# EAGLE design 1_ATMEGA_328P_AU (EAGLE 9.4.2)
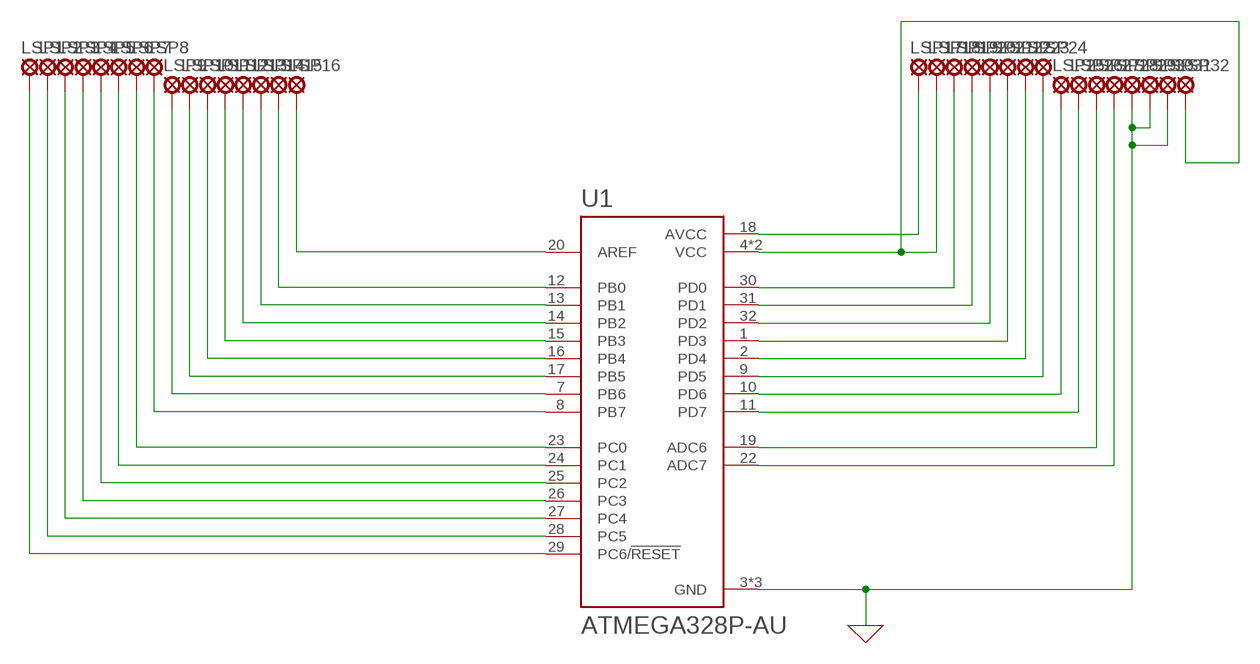
[diagram p0: schematic, sheet 1]

## Parts
LSP1  LSP10_CLSP10_C  [LSP10_C]
LSP2  LSP10_CLSP10_C  [LSP10_C]
LSP3  LSP10_CLSP10_C  [LSP10_C]
LSP4  LSP10_CLSP10_C  [LSP10_C]
LSP5  LSP10_CLSP10_C  [LSP10_C]
LSP6  LSP10_CLSP10_C  [LSP10_C]
LSP7  LSP10_CLSP10_C  [LSP10_C]
LSP8  LSP10_CLSP10_C  [LSP10_C]
LSP9  LSP10_CLSP10_C  [LSP10_C]
LSP10  LSP10_CLSP10_C  [LSP10_C]
LSP11  LSP10_CLSP10_C  [LSP10_C]
LSP12  LSP10_CLSP10_C  [LSP10_C]
LSP13  LSP10_CLSP10_C  [LSP10_C]
LSP14  LSP10_CLSP10_C  [LSP10_C]
LSP15  LSP10_CLSP10_C  [LSP10_C]
LSP16  LSP10_CLSP10_C  [LSP10_C]
LSP17  LSP10_CLSP10_C  [LSP10_C]
LSP18  LSP10_CLSP10_C  [LSP10_C]
LSP19  LSP10_CLSP10_C  [LSP10_C]
LSP20  LSP10_CLSP10_C  [LSP10_C]
LSP21  LSP10_CLSP10_C  [LSP10_C]
LSP22  LSP10_CLSP10_C  [LSP10_C]
LSP23  LSP10_CLSP10_C  [LSP10_C]
LSP24  LSP10_CLSP10_C  [LSP10_C]
LSP25  LSP10_CLSP10_C  [LSP10_C]
LSP26  LSP10_CLSP10_C  [LSP10_C]
LSP27  LSP10_CLSP10_C  [LSP10_C]
LSP28  LSP10_CLSP10_C  [LSP10_C]
LSP29  LSP10_CLSP10_C  [LSP10_C]
LSP30  LSP10_CLSP10_C  [LSP10_C]
LSP31  LSP10_CLSP10_C  [LSP10_C]
LSP32  LSP10_CLSP10_C  [LSP10_C]
U1  ATMEGA328P-AU  [QFP80P900X900X120-32N]

## Nets
0: LSP29.P$1(MP) LSP30.P$1(MP) LSP31.P$1(MP) U1.3(GND) U1.5(GND) U1.21(GND) ; supply symbol labelled GND
N$1: LSP1.P$1(MP) U1.29(PC6/!RESET)
N$2: LSP2.P$1(MP) U1.28(PC5)
N$3: LSP3.P$1(MP) U1.27(PC4)
N$4: LSP4.P$1(MP) U1.26(PC3)
N$5: LSP5.P$1(MP) U1.25(PC2)
N$6: LSP6.P$1(MP) U1.24(PC1)
N$7: LSP7.P$1(MP) U1.23(PC0)
N$8: LSP8.P$1(MP) U1.8(PB7)
N$9: LSP9.P$1(MP) U1.7(PB6)
N$10: LSP10.P$1(MP) U1.17(PB5)
N$11: LSP11.P$1(MP) U1.16(PB4)
N$12: LSP12.P$1(MP) U1.15(PB3)
N$13: LSP13.P$1(MP) U1.14(PB2)
N$14: LSP14.P$1(MP) U1.13(PB1)
N$15: LSP15.P$1(MP) U1.12(PB0)
N$16: LSP16.P$1(MP) U1.20(AREF)
N$17: LSP17.P$1(MP) U1.18(AVCC)
N$18: LSP18.P$1(MP) LSP32.P$1(MP) U1.4(VCC) U1.6(VCC)
N$19: LSP19.P$1(MP) U1.30(PD0)
N$20: LSP20.P$1(MP) U1.31(PD1)
N$21: LSP21.P$1(MP) U1.32(PD2)
N$22: LSP22.P$1(MP) U1.1(PD3)
N$23: LSP23.P$1(MP) U1.2(PD4)
N$24: LSP24.P$1(MP) U1.9(PD5)
N$25: LSP25.P$1(MP) U1.10(PD6)
N$26: LSP26.P$1(MP) U1.11(PD7)
N$27: LSP27.P$1(MP) U1.19(ADC6)
N$28: LSP28.P$1(MP) U1.22(ADC7)

## Library data of the parts
LSP1-LSP32 = tbtaco-solpad:LSP10_C: SOLDER PAD drill 1.0 mm, distributor Buerklin, 12H555
U1 = ATMEGA328P-AU:ATMEGA328P-AU: ATmega Series 20 MHz 32 KB Flash 2 KB SRAM 8-Bit Microcontroller - TQFP-32; AVAILABILITY: Unavailable; DESCRIPTION: Microcontroller Mcu, 8 Bit, Atmega, 20mhz, Tqfp-32; MF: Microchip; MP: ATMEGA328P-AU; PACKAGE: TQFP-32 Microchip; PRICE: None

## Board
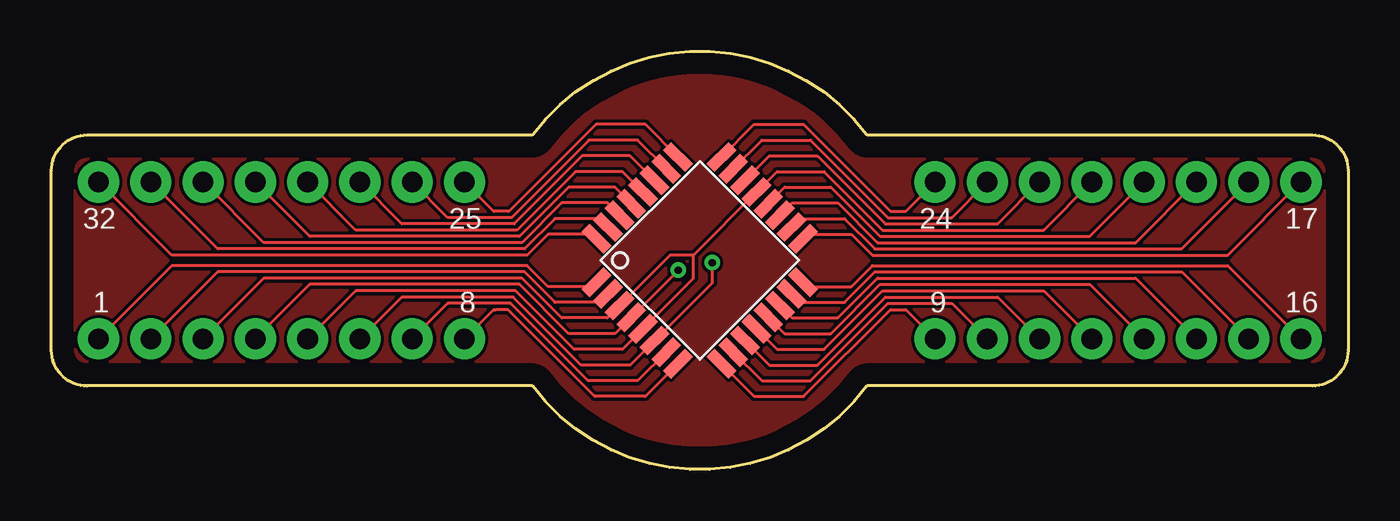
[diagram p1: board, top side]
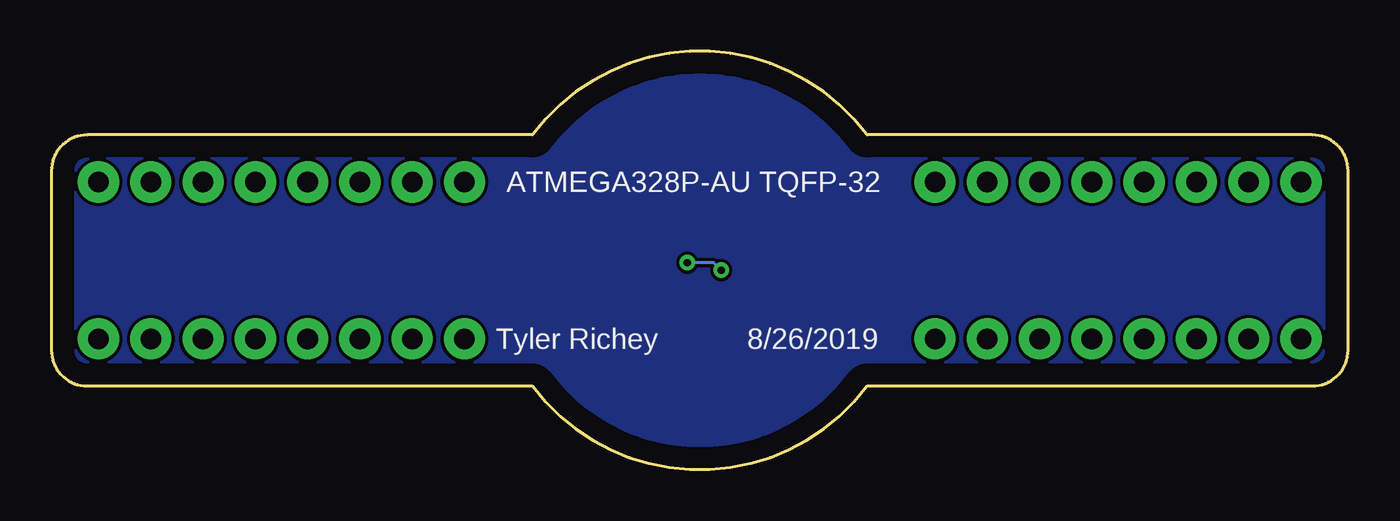
[diagram p2: board, bottom side, seen from below]

Size 62.99 x 20.3 mm. Coordinates in mm from the lower left corner, seen from the top.
Outline: 62.99,14.51 62.99,5.79 arc-90 61.26,4.05 39.62,4.05 arc-106 23.37,4.05 1.73,4.05 arc-90 0,5.79 0,14.51 arc-90 1.73,16.24 23.37,16.24 arc-106 39.62,16.24 61.26,16.24 arc-90 62.99,14.51
Copper layers (1*16): Top 0.035mm / dielectric 1.5mm / Bottom 0.035mm
Design rules "default": minimum track width 6mil, minimum drill 0.35mm, track to track 6mil, track to pad 6mil, pad to pad 6mil, via to via 6mil, smd to smd 6mil, copper to edge 40mil, drill to drill 6mil, minimum pad ring 10mil, minimum via ring 8mil, stop-mask expansion 4mil, vias tented up to drill 0mil, thermal gap 10mil

### Footprints (pad centres in the part's own frame; a part is rotated, then mirrored left to right if it is on the bottom)
LSP10_C = drill 1 pad 2: P$1 0,0
QFP80P900X900X120-32N = smd 1.5 x 0.55: 1 -4.3,2.8; 2 -4.3,2; 3 -4.3,1.2; 4 -4.3,0.4; 5 -4.3,-0.4; 6 -4.3,-1.2; 7 -4.3,-2; 8 -4.3,-2.8; 17 4.3,-2.8; 18 4.3,-2; 19 4.3,-1.2; 20 4.3,-0.4; 21 4.3,0.4; 22 4.3,1.2; 23 4.3,2; 24 4.3,2.8 | smd 0.55 x 1.5: 9 -2.8,-4.3; 10 -2,-4.3; 11 -1.2,-4.3; 12 -0.4,-4.3; 13 0.4,-4.3; 14 1.2,-4.3; 15 2,-4.3; 16 2.8,-4.3; 25 2.8,4.3; 26 2,4.3; 27 1.2,4.3; 28 0.4,4.3; 29 -0.4,4.3; 30 -1.2,4.3; 31 -2,4.3; 32 -2.8,4.3

### Placement (x,y rotation side)
LSP1  9.91,13.96 0 top
LSP2  12.45,13.96 0 top
LSP3  14.99,13.96 0 top
LSP4  17.53,13.96 0 top
LSP5  20.07,13.96 0 top
LSP6  42.93,13.96 0 top
LSP7  45.47,13.96 0 top
LSP8  20.07,6.34 0 top
LSP9  17.53,6.34 0 top
LSP10  60.71,13.96 0 top
LSP11  60.71,6.34 0 top
LSP12  58.17,6.34 0 top
LSP13  55.63,6.34 0 top
LSP14  53.09,6.34 0 top
LSP15  50.55,6.34 0 top
LSP16  53.09,13.96 0 top
LSP17  58.17,13.96 0 top
LSP18  14.99,6.34 0 top
LSP19  7.37,13.96 0 top
LSP20  4.83,13.96 0 top
LSP21  2.29,13.96 0 top
LSP22  2.29,6.34 0 top
LSP23  4.83,6.34 0 top
LSP24  42.93,6.34 0 top
LSP25  45.47,6.34 0 top
LSP26  48.01,6.34 0 top
LSP27  55.63,13.96 0 top
LSP28  48.01,13.96 0 top
LSP29  50.55,13.96 0 top
LSP30  12.45,6.34 0 top
LSP31  7.37,6.34 0 top
LSP32  9.91,6.34 0 top
U1  31.5,10.15 45 top

### Tracks (layer width: path | path; a pad name or v marks a point on that pad's centre or on a via)
0
  Top 0.152: LSP30.P$1 14.78,8.67 22.55,8.67 25.4,5.83 27.74,5.83 U1.5 31.18,9.27 31.18,10.4 | LSP31.P$1 10.31,9.28 22.86,9.28 24.79,7.35 27.01,7.35 U1.3 30.05,10.4 31.18,10.4 | 31.18,10.4 U1.21 35.25,14.47 37.54,14.47 40.38,11.62 48.21,11.62 LSP29.P$1
GND
  pour Top: 1.02,16.5 -0.25,15.23 -0.25,5.07 1.02,3.8 22.61,3.8 25.15,1.26 26.42,1.26 27.69,-0.01 28.96,-0.01 35.31,-0.01 36.58,1.26 37.85,1.26 40.39,3.8 49.28,3.8 61.98,3.8 63.25,5.07 63.25,15.23 61.98,16.5 40.39,16.5 37.85,19.04 36.58,19.04 35.31,20.31 27.69,20.31 26.42,19.04 25.15,19.04 22.61,16.5 3.56,16.5
  pour Bottom: 1.02,16.5 -0.25,15.23 -0.25,5.07 1.02,3.8 22.61,3.8 25.15,1.26 26.42,1.26 27.69,-0.01 35.31,-0.01 36.58,1.26 37.85,1.26 40.39,3.8 48.01,3.8 61.98,3.8 63.25,5.07 63.25,15.23 61.98,16.5 40.39,16.5 37.85,19.04 36.58,19.04 35.31,20.31 34.04,20.31 27.69,20.31 26.42,19.04 25.15,19.04 22.61,16.5
N$1
  Top 0.152: U1.29 27.37,13.7 25.12,13.7 22.73,11.32 12.55,11.32 LSP1.P$1
N$2
  Top 0.152: U1.28 27.74,14.47 25.45,14.47 22.61,11.62 14.78,11.62 LSP2.P$1
N$3
  Top 0.152: U1.27 28.11,15.23 25.78,15.23 22.48,11.93 17.02,11.93 LSP3.P$1
N$4
  Top 0.152: U1.26 28.48,15.99 26.12,15.99 22.36,12.23 19.25,12.23 LSP4.P$1
N$5
  Top 0.152: U1.25 28.85,16.75 26.45,16.75 22.23,12.54 21.49,12.54 LSP5.P$1
N$6
  Top 0.152: U1.24 34.14,16.75 36.55,16.75 40.76,12.54 41.5,12.54 LSP6.P$1
N$7
  Top 0.152: U1.23 34.51,15.99 36.88,15.99 40.64,12.23 43.74,12.23 LSP7.P$1
N$8
  Top 0.152: U1.8 28.85,3.54 26.39,3.54 22.18,7.76 21.84,7.76 21.59,7.76 21.49,7.76 LSP8.P$1
N$9
  Top 0.152: U1.7 28.48,4.31 26.06,4.31 22.3,8.06 19.25,8.06 LSP9.P$1
N$10
  Top 0.152: U1.17 36.73,11.42 38.86,11.42 39.88,10.4 57.15,10.4 LSP10.P$1
N$11
  Top 0.152: U1.16 36.73,8.88 38.86,8.88 39.88,9.89 57.15,9.89 LSP11.P$1
N$12
  Top 0.152: U1.15 36.36,8.12 38.53,8.12 40,9.59 54.91,9.59 LSP12.P$1
N$13
  Top 0.152: U1.14 35.99,7.35 38.2,7.35 40.13,9.28 52.68,9.28 LSP13.P$1
N$14
  Top 0.152: U1.13 35.62,6.59 37.87,6.59 40.26,8.98 50.44,8.98 LSP14.P$1
N$15
  Top 0.152: U1.12 35.25,5.83 37.54,5.83 40.38,8.67 48.21,8.67 LSP15.P$1
N$16
  Top 0.152: U1.20 35.62,13.7 37.87,13.7 40.26,11.32 50.44,11.32 LSP16.P$1
N$17
  Top 0.152: U1.18 36.36,12.18 38.53,12.18 40,10.71 54.91,10.71 LSP17.P$1
N$18  (via drill 0.35)
  Top 0.152: LSP18.P$1 17.02,8.37 22.43,8.37 25.73,5.07 28.11,5.07 U1.6 32.11,9.06 v32.11,10.04 | LSP32.P$1 12.55,8.98 22.73,8.98 25.12,6.59 27.37,6.59 U1.4 v30.45,9.67
  Bottom 0.152: v30.45,9.67 30.82,10.04 v32.11,10.04
N$19
  Top 0.152: U1.30 27.01,12.94 24.79,12.94 22.86,11.01 10.31,11.01 LSP19.P$1
N$20
  Top 0.152: U1.31 26.64,12.18 24.46,12.18 22.99,10.71 8.08,10.71 LSP20.P$1
N$21
  Top 0.152: U1.32 26.27,11.42 24.13,11.42 23.11,10.4 5.84,10.4 LSP21.P$1
N$22
  Top 0.152: U1.1 26.27,8.88 24.13,8.88 23.11,9.89 5.84,9.89 LSP22.P$1
N$23
  Top 0.152: U1.2 26.64,8.12 24.46,8.12 22.99,9.59 8.08,9.59 LSP23.P$1
N$24
  Top 0.152: U1.9 34.14,3.54 36.55,3.54 40.76,7.76 41.5,7.76 LSP24.P$1
N$25
  Top 0.152: U1.10 34.51,4.31 36.88,4.31 40.64,8.06 43.74,8.06 LSP25.P$1
N$26
  Top 0.152: U1.11 34.88,5.07 37.21,5.07 40.51,8.37 45.97,8.37 LSP26.P$1
N$27
  Top 0.152: U1.19 35.99,12.94 38.2,12.94 40.13,11.01 52.68,11.01 LSP27.P$1
N$28
  Top 0.152: U1.22 34.88,15.23 37.21,15.23 40.51,11.93 45.97,11.93 LSP28.P$1

### Text on the board
tPlace: 32 | 25 | 24 | 17 | 1 | 8 | 9 | 16
bPlace: ATMEGA328P-AU TQFP-32 | 8/26/2019 | Tyler Richey